# Altium schematic sheet Main.SchDoc
size A3; SheetNumber: 1; SheetTotal: 1
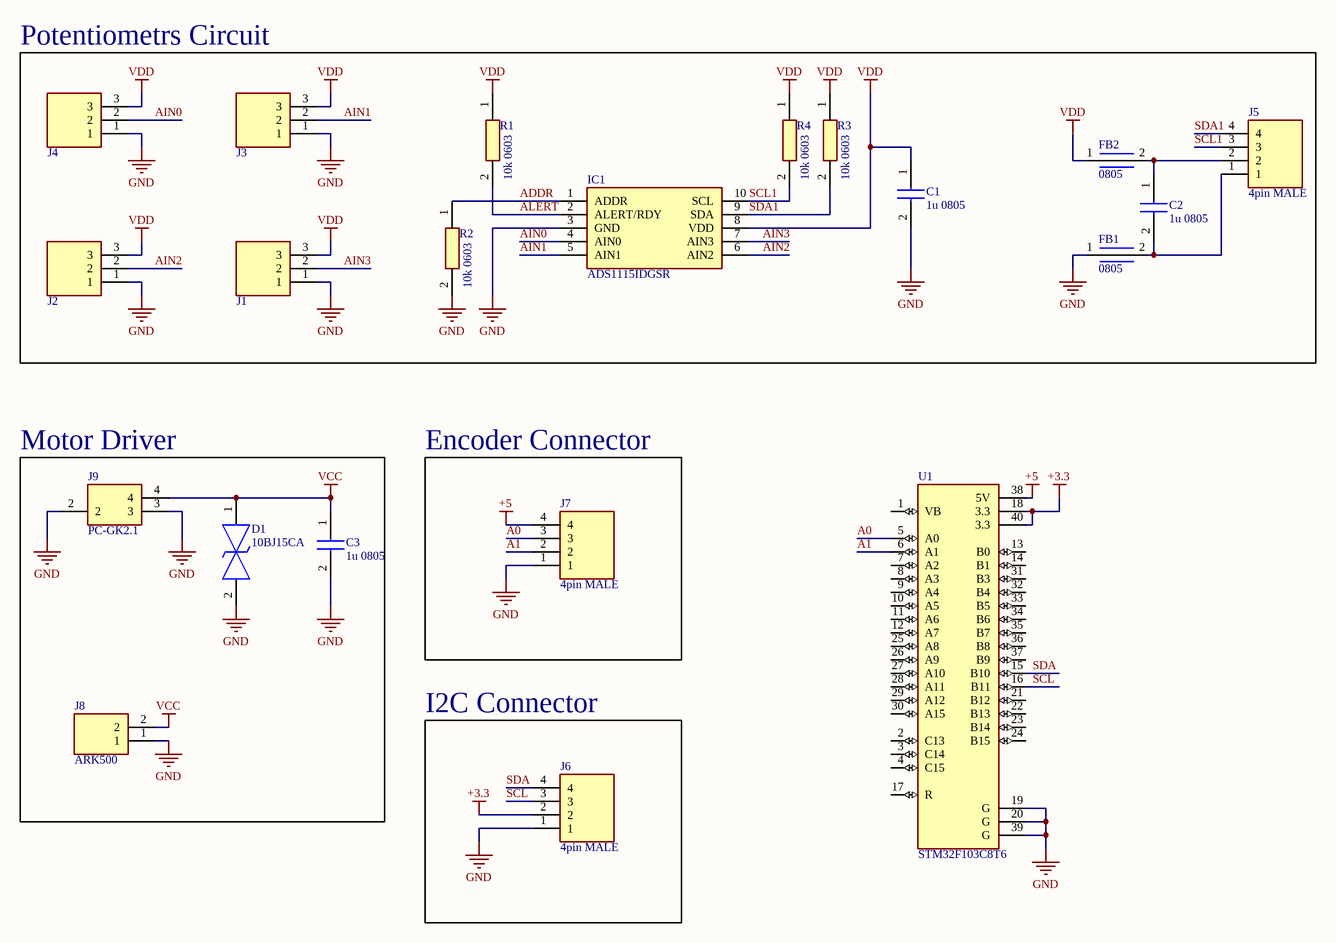
[diagram p0: Main.SchDoc]

## Parts
C1  1u 0805  [CAPC2012X135N]
C2  1u 0805  [CAPC2012X135N]
C3  1u 0805  [CAPC2012X135N]
D1  10BJ15CA  [10BJ15CA]
FB1  0805  [MFBM1V2012102R]
FB2  0805  [MFBM1V2012102R]
IC1  ADS1115IDGSR  [SOP50P490X110-10N]
J1  3pin MALE  [S3BPHKSLFSN]  (value not drawn)
J2  3pin MALE  [S3BPHKSLFSN]  (value not drawn)
J3  3pin MALE  [S3BPHKSLFSN]  (value not drawn)
J4  3pin MALE  [S3BPHKSLFSN]  (value not drawn)
J5  4pin MALE  [S4BPHKSLFSN]
J6  4pin MALE  [S4BPHKSLFSN]
J7  4pin MALE  [S4BPHKSLFSN]
J8  ARK500  [TB50P2PBL]
J9  PC-GK2.1  [PCGK21]
R1  10k 0603  [RESC1608X60N]
R2  10k 0603  [RESC1608X60N]
R3  10k 0603  [RESC1608X60N]
R4  10k 0603  [RESC1608X60N]
U1  STM32F103C8T6  [MODULE_ZC323000]

## Blocks framed on the sheet
Potentiometrs Circuit: C1 C2 FB1 FB2 IC1 J1-J5 R1-R4
Motor Driver: C3 D1 J8 J9
Encoder Connector: J7
I2C Connector: J6

## Nets
+3.3: J6.2 U1.18(3.3) U1.40(3.3)
+5: J7.4 U1.38(5V)
GND: C1.2 C3.2 D1.2 FB1.1 IC1.3(GND) J1.1 J2.1 J3.1 J4.1 J6.1 J7.1 J8.1 J9.2 J9.3 R2.2 U1.19(G) U1.20(G) U1.39(G)
VCC: C3.1 D1.1 J8.2 J9.4
VDD: C1.1 FB2.1 IC1.8(VDD) J1.3 J2.3 J3.3 J4.3 R1.1 R3.1 R4.1
A0: J7.3 U1.5(A0)
A1: J7.2 U1.6(A1)
ADDR: IC1.1(ADDR) R2.1
AIN0: IC1.4(AIN0) J4.2
AIN1: IC1.5(AIN1) J3.2
AIN2: IC1.6(AIN2) J2.2
AIN3: IC1.7(AIN3) J1.2
ALERT: IC1.2(ALERT/RDY) R1.2
SCL: J6.3 U1.16(B11)
SCL1: IC1.10(SCL) J5.3 R4.2
SDA: J6.4 U1.15(B10)
SDA1: IC1.9(SDA) J5.4 R3.2
NetC2_1: C2.1 FB2.2 J5.2
NetC2_2: C2.2 FB1.2 J5.1

Not connected (* = marked no-connect by the designer): U1 1(VB) 2(C13) 3(C14) 4(C15) 7(A2) 8(A3) 9(A4) 10(A5) 11(A6) 12(A7) 13(B0) 14(B1) 17(R) 21(B12) 22(B13) 23(B14) 24(B15) 25(A8) 26(A9) 27(A10) 28(A11) 29(A12) 30(A15) 31(B3) 32(B4) 33(B5) 34(B6) 35(B7) 36(B8) 37(B9)

## Library data of the parts
C1-C3 = CL21B105KBFNNNE: Capacitor; Manufacturer_Name: SAMSUNG; Datasheet Link: https://componentsearchengine.com/Datasheets/2/CL21B105KBFNNNE.pdf; Height: 1.35mm; Manufacturer_Part_Number: CL21B105KBFNNNE; Mouser Part Number: 187-CL21B105KBFNNNE; Mouser Price/Stock: https://www.mouser.co.uk/ProductDetail/Samsung-Electro-Mechanics/CL21B105KBFNNNE?qs=yOVawPpwOwmddQEBPU6Y9A%3D%3D; Arrow Part Number: CL21B105KBFNNNE; Arrow Price/Stock: https://www.arrow.com/en/products/cl21b105kbfnnne/samsung-electro-mechanics?region=europe
D1 = 10BJ15CA: TVS Diode (Bi-directional); Manufacturer_Name: Eaton; Datasheet Link: https://www.eaton.com/content/dam/eaton/products/electronic-components/resources/data-sheet/eaton-10bj-tvs-diode-power-esd-suppressor-data-sheet.pdf; Height: 2.4mm; Manufacturer_Part_Number: 10BJ15CA; Mouser Part Number: 504-10BJ15CA; Mouser Price/Stock: https://www.mouser.co.uk/ProductDetail/Eaton-Electronics/10BJ15CA?qs=zW32dvEIR3u4l1NPNgEw9g%3D%3D
FB1 FB2 = MFBM1V2012-102-R: Ferrite Bead; Manufacturer_Name: Eaton; Datasheet Link: https://www.eaton.com/content/dam/eaton/products/electronic-components/resources/data-sheet/eaton-mfbm1v2012-high-current-multilayer-ferrite-chip-bead-data-sheet.pdf; Height: 1.1mm; Manufacturer_Part_Number: MFBM1V2012-102-R; Arrow Part Number: MFBM1V2012-102-R; Arrow Price/Stock: https://www.arrow.com/en/products/mfbm1v2012-102-r/eaton?region=nac
IC1 = ADS1115IDGSR: Integrated Circuit; Manufacturer_Name: Texas Instruments; Datasheet Link: http://www.ti.com/lit/gpn/ADS1115; Height: 1.1mm; Manufacturer_Part_Number: ADS1115IDGSR; Mouser Part Number: 595-ADS1115IDGSR; Mouser Price/Stock: https://www.mouser.co.uk/ProductDetail/Texas-Instruments/ADS1115IDGSR?qs=IK5e5L0zOXjKCJoVMhYO%2FQ%3D%3D; Arrow Part Number: ADS1115IDGSR; Arrow Price/Stock: https://www.arrow.com/en/products/ads1115idgsr/texas-instruments?utm_currency=USD&region=nac
J1-J4 = S3B-PH-K-S__LF__SN_: Connector; Manufacturer_Name: JST (JAPAN SOLDERLESS TERMINALS); Manufacturer_Part_Number: S3B-PH-K-S (LF)(SN); Datasheet Link: http://www.farnell.com/datasheets/2057211.pdf; Height: 4.8mm
J5-J7 = S4B-PH-K-S__LF__SN_: Connector; Manufacturer_Name: JST (JAPAN SOLDERLESS TERMINALS); Manufacturer_Part_Number: S4B-PH-K-S (LF)(SN); Datasheet Link: sdfsds; Height: 4.8mm
J8 = TB-5.0-P-2P_BL: TB-5.0-P-2P_BL, Connector; Manufacturer_Name: Ninigi; Manufacturer_Part_Number: TB-5.0-P-2P/BL; Datasheet Link: https://ninigi.com/gb/en/product/ninigi/terminal-blocks/tb-5.0-p-2p%252Fbl/tb-5-0-p-2p-bl/113584/; Height: 10mm
J9 = PC-GK2.1: Connector; Manufacturer_Name: Ninigi; Datasheet Link: https://www.tme.eu/Document/78afd4fb8a41e4211137cd818ea9e93d/PC-GK21.jpg; Height: 11.2mm; Manufacturer_Part_Number: PC-GK2.1
R1-R4 = WR06X1002FTL: Resistor; Manufacturer_Name: Walsin Technology Corporation; Datasheet Link: https://4donline.ihs.com/images/VipMasterIC/IC/WATC/WATCS01091/WATCS01091-1.pdf?hkey=EF798316E3902B6ED9A73243A3159BB0; Height: 0.6mm; Manufacturer_Part_Number: WR06X1002FTL; Mouser Part Number: 791-WR06X1002FTL; Mouser Price/Stock: https://www.mouser.co.uk/ProductDetail/Walsin/WR06X1002FTL?qs=1w%252B2sDiFrrGhwDUNQrfEaQ%3D%3D; Arrow Part Number: WR06X1002FTL; Arrow Price/Stock: https://www.arrow.com/en/products/wr06x1002ftl/walsin-technology?region=europe
U1 = CMP-007-000000-1: STM32F103C8T6 ARM STM32 Minimum System Development Board Module For Arduino; Pin Count: 40; Package: None; Availability: Unavailable; Source: ZC323000.SchLib; Design Item ID: ZC323000; Price: None; MP: ZC323000; Component Type: Standard; Value: *